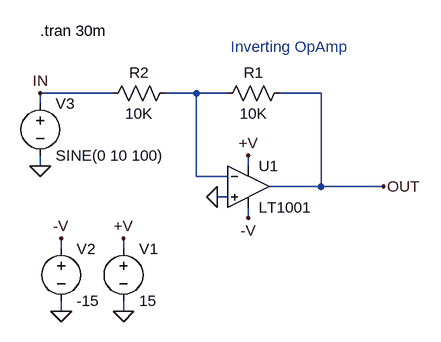
[diagram p0: schematic opamp_configs.asc]
opamp_configs.asc, the LTspice schematic file:
Version 4
SHEET 1 896 680
WIRE -16 96 -128 96
WIRE 112 96 64 96
WIRE 160 96 112 96
WIRE 304 96 240 96
WIRE -128 112 -128 96
WIRE -128 208 -128 192
WIRE 192 208 192 192
WIRE 112 224 112 96
WIRE 160 224 112 224
WIRE 304 240 304 96
WIRE 304 240 224 240
WIRE 400 240 304 240
WIRE 160 256 144 256
WIRE 192 288 192 272
WIRE -96 336 -96 320
WIRE 0 336 0 320
WIRE -96 432 -96 416
WIRE 0 432 0 416
FLAG 0 432 0
FLAG 192 192 +V
FLAG 0 320 +V
FLAG 192 288 -V
FLAG -96 432 0
FLAG -96 320 -V
FLAG -128 208 0
FLAG 144 256 0
FLAG -128 96 IN
FLAG 400 240 OUT
SYMBOL voltage 0 320 R0
SYMATTR InstName V1
SYMATTR Value 15
SYMBOL opamps\\LT1001 192 176 R0
SYMATTR InstName U1
SYMBOL voltage -96 320 R0
SYMATTR InstName V2
SYMATTR Value -15
SYMBOL res 256 80 R90
WINDOW 0 0 56 VBottom 2
WINDOW 3 32 56 VTop 2
SYMATTR InstName R1
SYMATTR Value 10K
SYMBOL voltage -128 96 R0
WINDOW 123 0 0 Left 2
WINDOW 39 0 0 Left 2
SYMATTR InstName V3
SYMATTR Value SINE(0 10 100)
SYMBOL res 80 80 R90
WINDOW 0 0 56 VBottom 2
WINDOW 3 32 56 VTop 2
SYMATTR InstName R2
SYMATTR Value 10K
TEXT -128 0 Left 2 !.tran 30m
TEXT 256 40 Bottom 2 ;Inverting OpAmp

The netlist it stands for:
* opamp_configs.asc
V1 +V 0 15
XU1 0 N001 +V -V OUT LT1001  ; pins In+ In- V+ V- OUT
V2 -V 0 -15
R1 OUT N001 10K
V3 IN 0 SINE(0 10 100)
R2 N001 IN 10K
.tran 30m
* Inverting OpAmp
.lib LTC.lib
.backanno
.end